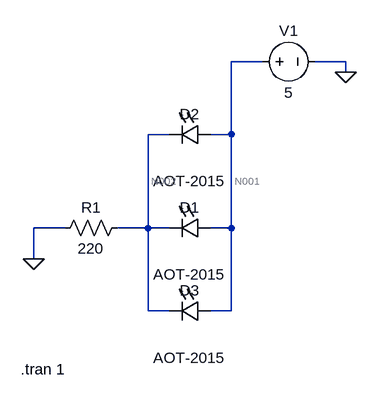
[diagram p0: schematic LED Segment.asc]
LED Segment.asc, the LTspice schematic file:
Version 4
SHEET 1 880 776
WIRE 400 -80 352 -80
WIRE 528 -80 480 -80
WIRE 528 -64 528 -80
WIRE 256 32 224 32
WIRE 352 32 352 -80
WIRE 352 32 320 32
WIRE 96 176 48 176
WIRE 224 176 224 32
WIRE 224 176 176 176
WIRE 256 176 224 176
WIRE 352 176 352 32
WIRE 352 176 320 176
WIRE 48 224 48 176
WIRE 224 304 224 176
WIRE 256 304 224 304
WIRE 352 304 352 176
WIRE 352 304 320 304
FLAG 48 224 0
FLAG 528 -64 0
SYMBOL res 192 160 R90
WINDOW 0 0 56 VBottom 2
WINDOW 3 32 56 VTop 2
SYMATTR InstName R1
SYMATTR Value 220
SYMBOL LED 320 16 R90
WINDOW 0 0 32 VBottom 2
WINDOW 3 72 32 VTop 2
SYMATTR InstName D2
SYMATTR Value AOT-2015
SYMBOL voltage 384 -80 R270
WINDOW 0 32 56 VTop 2
WINDOW 3 -32 56 VBottom 2
WINDOW 123 0 0 Left 2
WINDOW 39 0 0 Left 2
SYMATTR InstName V1
SYMATTR Value 5
SYMBOL LED 320 160 R90
WINDOW 0 0 32 VBottom 2
WINDOW 3 72 32 VTop 2
SYMATTR InstName D1
SYMATTR Value AOT-2015
SYMBOL LED 320 288 R90
WINDOW 0 0 32 VBottom 2
WINDOW 3 72 32 VTop 2
SYMATTR InstName D3
SYMATTR Value AOT-2015
TEXT 28 394 Left 2 !.tran 1

The netlist it stands for:
* LED Segment.asc
R1 N002 0 220
D2 N001 N002 AOT-2015
V1 N001 0 5
D1 N001 N002 AOT-2015
D3 N001 N002 AOT-2015
.model D D
.lib standard.dio
.tran 1
.backanno
.end

* Results of the author's LTspice run, read from the files saved beside the schematic
* Operating Point, zero values left out:
*   V(n002) = 2.477 V
*   V(n001) = 5 V
*   I(D3) = 3.752 mA
*   I(D1) = 3.752 mA
*   I(D2) = 3.752 mA
*   I(R1) = 11.26 mA
*   I(V1) = -11.26 mA